# EAGLE design grove (EAGLE 6.5.0)
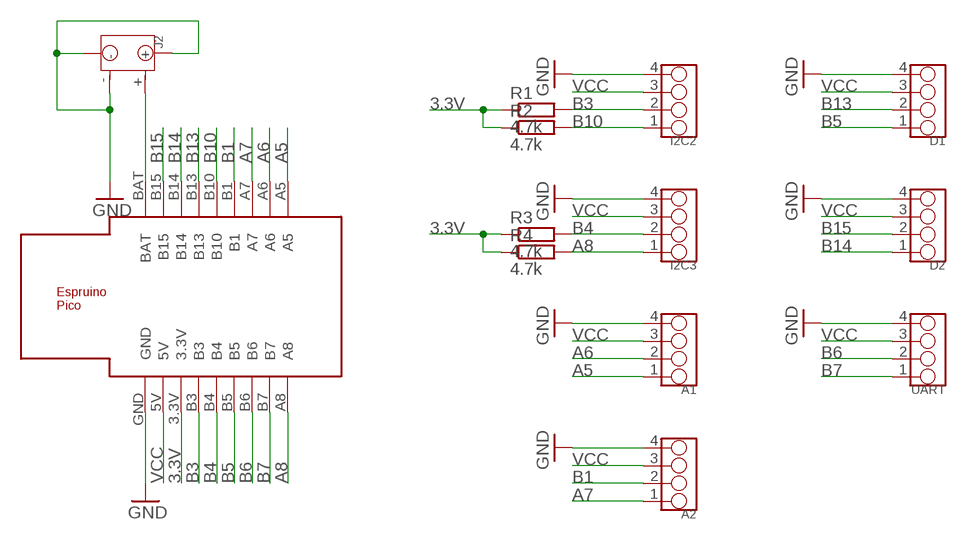
[diagram p0: schematic, sheet 1]

## Parts
A1  GROVE-4P-2.0-3470130P1  [4P-2.0]
A2  GROVE-4P-2.0-3470130P1  [4P-2.0]
D1  GROVE-4P-2.0-3470130P1  [4P-2.0]
D2  GROVE-4P-2.0-3470130P1  [4P-2.0]
I2C2  GROVE-4P-2.0-3470130P1  [4P-2.0]
I2C3  GROVE-4P-2.0-3470130P1  [4P-2.0]
J2  JST-2P-SMD-PW-3410050P1  [2P-SMD-2.0-90D]
R1  4.7k  R-EU_R0805  [R0805]
R2  4.7k  R-EU_R0805  [R0805]
R3  4.7k  R-EU_R0805  [R0805]
R4  4.7k  R-EU_R0805  [R0805]
U$1  ESPRUINO_PICO_0.1  [ESPRUINO_PICO_0.1]
UART  GROVE-4P-2.0-3470130P1  [4P-2.0]

## Nets
3.3V [power]: R1.1 R2.1 R3.1 R4.1 U$1.3.3V
A5: A1.1 U$1.A5
A6: A1.2 U$1.A6
A7: A2.1 U$1.A7
A8: I2C3.1 R4.2 U$1.A8
B1: A2.2 U$1.B1
B3: I2C2.2 R1.2 U$1.B3
B4: I2C3.2 R3.2 U$1.B4
B5: D1.1 U$1.B5
B6: U$1.B6 UART.2
B7: U$1.B7 UART.1
B10: I2C2.1 R2.2 U$1.B10
B13: D1.2 U$1.B13
B14: D2.1 U$1.B14
B15: D2.2 U$1.B15
GND [power]: A1.4 A2.4 D1.4 D2.4 I2C2.4 I2C3.4 J2.3 J2.4 J2.- U$1.GND UART.4
N$1: J2.+ U$1.BAT
VCC [power]: A1.3 A2.3 D1.3 D2.3 I2C2.3 I2C3.3 U$1.5V UART.3

## Library data of the parts
A1 A2 D1 D2 I2C2 I2C3 UART = OPL Eagle Library:GROVE-4P-2.0
J2 = OPL Eagle Library:JST-2P-SMD-PW
R1-R4 = rcl:R-EU_: RESISTOR, European symbol
U$1 = espruino_pico:ESPRUINO_PICO_0.1

## Net classes
0 default: width 0.305 mm
1 power: width 0.406 mm

## Board
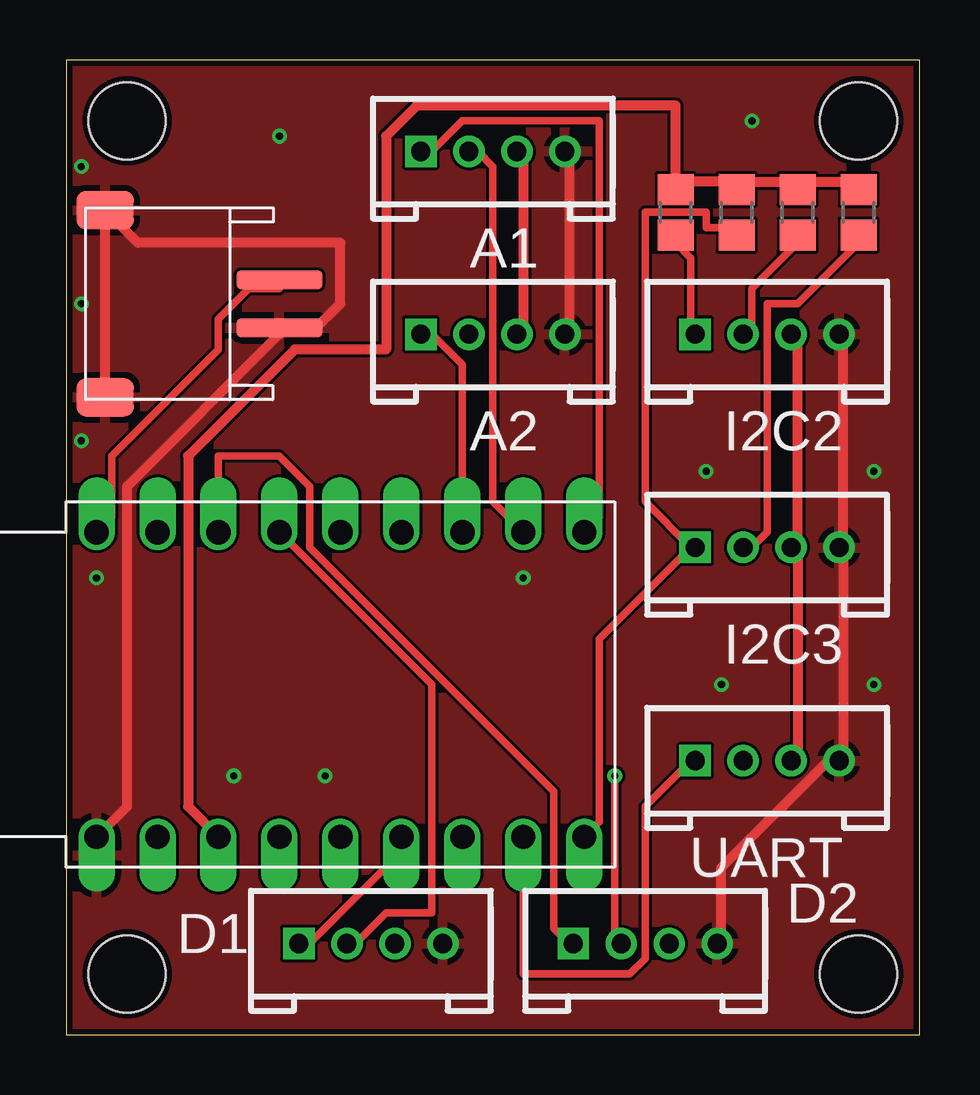
[diagram p1: board, top side]
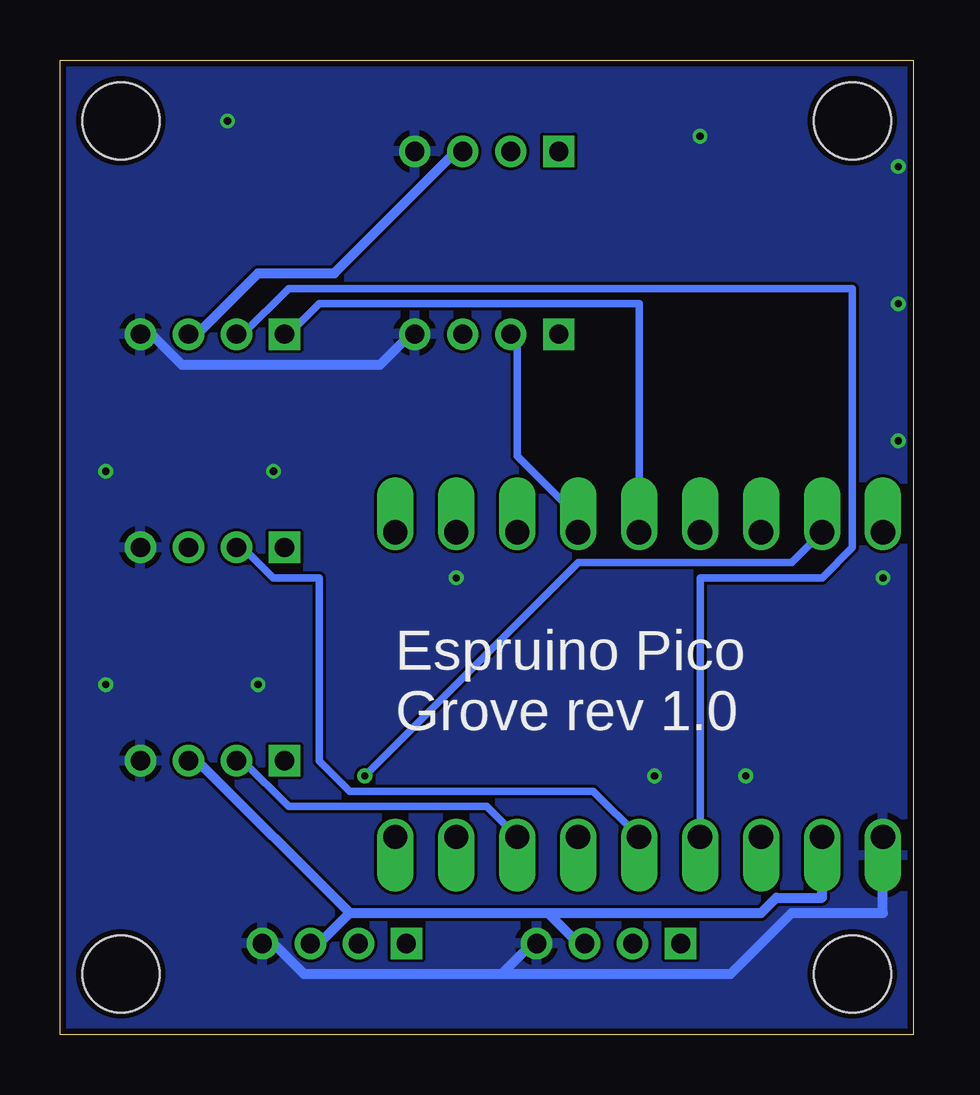
[diagram p2: board, bottom side, seen from below]

Size 35.56 x 40.64 mm. Coordinates in mm from the lower left corner, seen from the top.
Outline: 0,0 35.56,0 35.56,40.64 0,40.63 0,0
Copper layers (1*16): Top 0.035mm / dielectric 1.5mm / Bottom 0.035mm
Design rules "dirt_cheap_dirty_boards.v1": minimum track width 5mil, minimum drill 12mil, track to track 5mil, track to pad 5mil, pad to pad 5mil, via to via 5mil, smd to smd 0mil, copper to edge 10mil, drill to drill 10mil, minimum pad ring 10mil, minimum via ring 6mil, stop-mask expansion 2mil, vias tented up to drill 25mil, thermal gap 10mil
Holes 3.2 mm at 33.02,38.1 33.02,2.54 2.54,2.54 2.54,38.1

### Footprints (pad centres in the part's own frame; a part is rotated, then mirrored left to right if it is on the bottom)
4P-2.0 = drill 0.8 pad 1.27 square: 1 -3,0 | drill 0.8 pad 1.27: 2 -1,0; 3 1,0; 4 3,0
2P-SMD-2.0-90D = smd 1.6 x 2.4: 3 3.9,-2.181; 4 -3.9,-2.181 | smd 0.8 x 3.6: + -1,5.08; - 1,5.08
R0805 = smd 1.3 x 1.5: 1 -0.95,0; 2 0.95,0
ESPRUINO_PICO_0.1 = drill 1.016 offset: 3.3V -7.62,-6.35; 5V -10.16,-6.35; A5 7.62,6.35; A6 5.08,6.35; A7 2.54,6.35; A8 7.62,-6.35; B1 0,6.35; B3 -5.08,-6.35; B4 -2.54,-6.35; B5 0,-6.35; B6 2.54,-6.35; B7 5.08,-6.35; B10 -2.54,6.35; B13 -5.08,6.35; B14 -7.62,6.35; B15 -10.16,6.35; BAT -12.7,6.35; GND -12.7,-6.35

### Placement (x,y rotation side)
A1  17.78,36.83 0 top
A2  17.78,29.21 0 top
D1  12.7,3.81 0 top
D2  24.13,3.81 0 top
I2C2  29.21,29.21 0 top
I2C3  29.21,20.32 0 top
J2  3.81,30.48 270 top
R1  30.48,34.29 270 top
R2  25.4,34.29 270 top
R3  33.02,34.29 270 top
R4  27.94,34.29 270 top
U$1  13.97,14.61 0 top
UART  29.21,11.43 0 top

### Tracks (layer width: path | path; a pad name or v marks a point on that pad's centre or on a via)
3.3V
  Top 0.406: 27.94,35.56 25.4,35.56 | 27.94,35.56 30.48,35.56 | 27.94,35.56 R4.1 | 30.48,35.56 33.02,35.56 R3.1 | 30.48,35.56 R1.1 | U$1.3.3V 5.08,9.53 5.08,24.13 9.53,28.57 13.34,28.57 13.34,37.47 14.61,38.73 25.4,38.73 25.4,35.56 | 25.4,35.56 R2.1
A5
  Top 0.305: U$1.A5 22.23,21.59 22.23,38.1 16.51,38.1 15.24,36.83 A1.1
A6
  Top 0.305: U$1.A6 17.78,22.23 17.78,36.2 17.14,36.83 A1.2
A7
  Top 0.305: U$1.A7 16.51,27.94 15.24,29.21 A2.1
A8
  Top 0.305: 26.04,20.32 24.13,22.23 24.13,34.29 26.67,34.29 26.67,33.66 27.94,33.66 R4.2 | U$1.A8 22.23,8.89 22.23,16.51 26.04,20.32 | 26.04,20.32 I2C3.1
B1
  Bottom 0.305: U$1.B1 13.97,21.59 16.51,24.13 16.51,29.21 A2.2
B3
  Top 0.305: R1.2 30.48,33.02 28.57,31.11 28.57,29.21 I2C2.2
  Bottom 0.305: U$1.B3 8.89,19.05 3.81,19.05 2.54,20.32 2.54,31.11 26.04,31.11 27.94,29.21 I2C2.2
B4
  Top 0.305: R3.2 33.02,33.02 30.48,30.48 29.21,30.48 29.21,20.95 28.57,20.32 I2C3.2
  Bottom 0.305: U$1.B4 13.34,10.16 23.5,10.16 24.77,11.43 24.77,19.05 26.67,19.05 27.94,20.32 I2C3.2
B5
  Top 0.305: U$1.B5 13.97,7.62 10.16,3.81 D1.1
B6
  Bottom 0.305: U$1.B6 17.78,9.53 26.04,9.53 27.94,11.43 UART.2
B7
  Top 0.305: U$1.B7 19.05,2.54 23.5,2.54 24.13,3.17 24.13,9.53 26.04,11.43 UART.1
B10
  Top 0.305: R2.2 25.4,33.02 26.04,32.38 26.04,29.21 I2C2.1
  Bottom 0.305: U$1.B10 11.43,30.48 24.77,30.48 26.04,29.21 I2C2.1
B13
  Top 0.305: U$1.B13 15.24,14.61 15.24,5.08 13.34,5.08 12.06,3.81 D1.2
B14
  Top 0.305: U$1.B14 6.35,24.13 8.89,24.13 10.16,22.86 10.16,20.32 20.32,10.16 20.32,4.45 20.95,3.81 D2.1
B15  (via drill 0.3)
  Top 0.305: v22.86,10.79 22.86,3.81 D2.2
  Bottom 0.305: v22.86,10.79 13.97,19.68 5.08,19.68 U$1.B15
GND  (via drill 0.3)
  Top 0.406: A2.4 20.95,29.21 20.95,36.83 A1.4 | 32.38,20.32 32.38,11.43 UART.4 31.75,11.43 27.3,6.99 27.3,3.81 D2.4 | 32.38,20.32 32.38,29.21 I2C2.4 | 32.38,20.32 I2C3.4 | U$1.GND 2.54,9.53 2.54,22.86 8.89,29.21 J2.- 10.43,29.48 11.43,30.48 11.43,33.02 2.99,33.02 J2.4 J2.3
  Bottom 0.406: A2.4 20.95,29.21 22.23,27.94 30.48,27.94 31.75,29.21 I2C2.4 | 17.14,2.54 15.88,3.81 D1.4 | 17.14,2.54 25.4,2.54 26.67,3.81 D2.4 | U$1.GND 1.27,5.08 5.08,5.08 7.62,2.54 17.14,2.54
  other vias: 1.27,19.05 6.99,10.79 10.79,10.79 19.05,19.05 27.3,14.61 33.66,14.61 33.66,23.5 26.67,23.5 28.57,38.1 8.89,37.47 0.64,36.2 0.64,24.77 0.64,30.48
  pour Bottom: 0,40.64 35.56,40.64 35.56,0 0,0
  pour Top: 0,40.64 35.56,40.64 35.56,0 0,0
N$1
  Top 0.305: U$1.BAT 1.91,21.59 1.91,24.13 6.35,28.57 6.35,29.84 7.62,31.11 8.89,31.11 J2.+
VCC
  Top 0.406: A2.3 19.05,29.21 19.05,36.83 A1.3 | 30.48,20.32 30.48,11.43 UART.3 | 30.48,20.32 30.48,29.21 I2C2.3 | 30.48,20.32 I2C3.3
  Bottom 0.406: 15.24,5.08 13.97,3.81 D1.3 | 23.5,5.08 15.24,5.08 | 23.5,5.08 24.77,3.81 D2.3 | U$1.5V 3.81,5.71 5.71,5.71 6.35,5.08 15.24,5.08 | A1.3 19.05,36.83 24.13,31.75 27.3,31.75 29.84,29.21 I2C2.3 | 23.5,5.08 29.84,11.43 UART.3

### Text on the board
bNames: Espruino Pico / Grove rev 1.0